# EAGLE schematic Pendant (EAGLE 9.6.2)

## Sheet 1 of 3
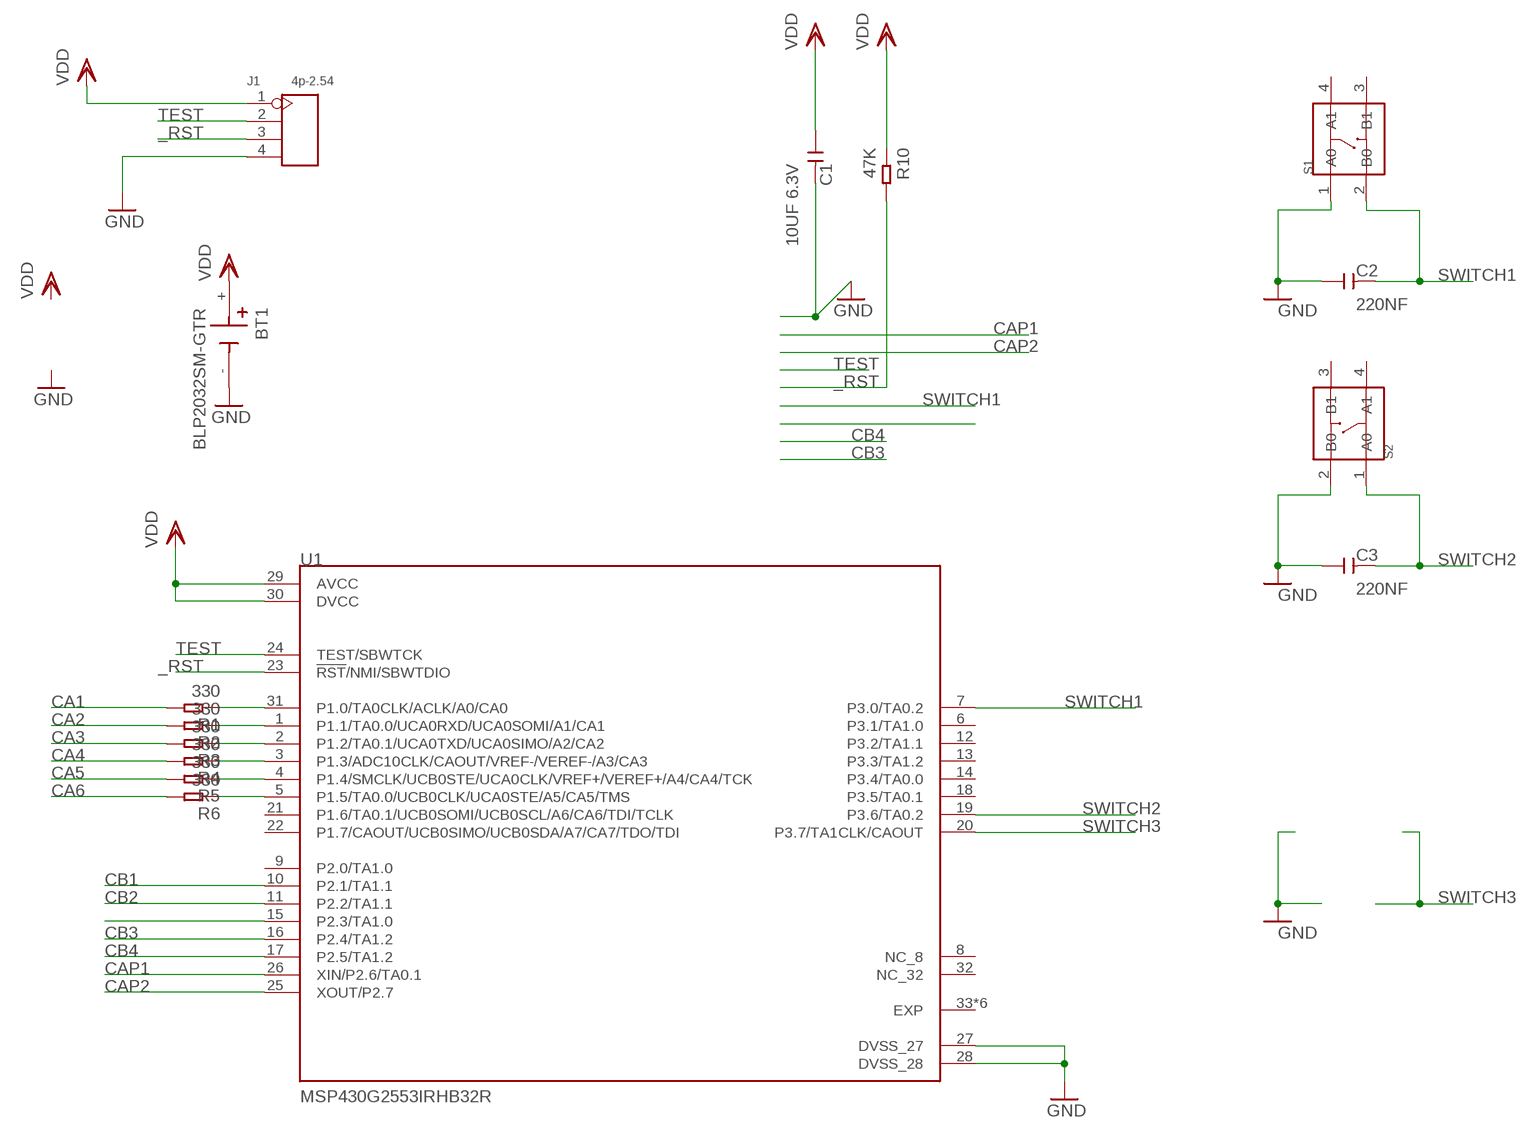
[diagram p0: schematic, sheet 1]

### Parts
BT1  BLP2032SM-GTR  [BAT_BLP2032SM-GTR]
C1  10UF 6.3V  CERAMIC-10UF-6.3V-20%-X5R(0603)  [C0603]
C2  220NF  CERAMIC-220NF-16V-10%-X7R(0402)  [C0402]
C3  220NF  CERAMIC-220NF-16V-10%-X7R(0402)  [C0402]
J1  4p-2.54  DIP-BLACK-MALE-HEADER-VERT(4P-2.54)  [H4-2.54]
R1  330  SMD-RES-330R-5%-1/8W(0805)  [R0805]
R2  330  SMD-RES-330R-5%-1/8W(0805)  [R0805]
R3  330  SMD-RES-330R-5%-1/8W(0805)  [R0805]
R4  330  SMD-RES-330R-5%-1/8W(0805)  [R0805]
R5  330  SMD-RES-330R-5%-1/8W(0805)  [R0805]
R6  330  SMD-RES-330R-5%-1/8W(0805)  [R0805]
R10  47K  SMD-RES-47K-5%-1/10W(0603)  [R0603]
S1  SMD-SWITCH-TACTILE-SPST-NO(4P-D6.0MM)  [SW4-SMD-6.0X6.0X5.0MM]
S2  SMD-SWITCH-TACTILE-SPST-NO(4P-D6.0MM)  [SW4-SMD-6.0X6.0X5.0MM]
U1  MSP430G2553IRHB32R  [IC_MSP430G2553IRHB32R]

### Nets
_RST: J1.3 R10.2 U1.23(!RST!/NMI/SBWTDIO)
CA1: R1.2 ; also sheet 2
CA2: R2.2 ; also sheet 2
CA3: R3.2 ; also sheet 2
CA4: R4.2 ; also sheet 2
CA5: R5.2 ; also sheet 2
CA6: R6.2 ; also sheet 2
CAP1: U1.26(XIN/P2.6/TA0.1)
CAP2: U1.25(XOUT/P2.7)
CB1: U1.10(P2.1/TA1.1) ; also sheet 2
CB2: U1.11(P2.2/TA1.1) ; also sheet 2
CB3: U1.16(P2.4/TA1.2) ; also sheet 2
CB4: U1.17(P2.5/TA1.2) ; also sheet 2
GND: BT1.- C1.2 C2.1 C3.1 J1.4 S1.1(A0) S2.2(B0) U1.27(DVSS_27) U1.28(DVSS_28)
N$2: R1.1 U1.31(P1.0/TA0CLK/ACLK/A0/CA0)
N$6: U1.15(P2.3/TA1.0)
N$10: R2.1 U1.1(P1.1/TA0.0/UCA0RXD/UCA0SOMI/A1/CA1)
N$11: R3.1 U1.2(P1.2/TA0.1/UCA0TXD/UCA0SIMO/A2/CA2)
N$12: R4.1 U1.3(P1.3/ADC10CLK/CAOUT/VREF-/VEREF-/A3/CA3)
N$13: R5.1 U1.4(P1.4/SMCLK/UCB0STE/UCA0CLK/VREF+/VEREF+/A4/CA4/TCK)
N$14: R6.1 U1.5(P1.5/TA0.0/UCB0CLK/UCA0STE/A5/CA5/TMS)
SWITCH1: C2.2 S1.2(B0) U1.7(P3.0/TA0.2)
SWITCH2: C3.2 S2.1(A0) U1.19(P3.6/TA0.2)
SWITCH3: U1.20(P3.7/TA1CLK/CAOUT)
TEST: J1.2 U1.24(TEST/SBWTCK)
VDD: BT1.+ C1.1 J1.1 R10.1 U1.29(AVCC) U1.30(DVCC)
Unconnected: S1.3(B1) S1.4(A1) S2.3(B1) S2.4(A1) U1.6(P3.1/TA1.0) U1.8(NC_8) U1.9(P2.0/TA1.0) U1.12(P3.2/TA1.1) U1.13(P3.3/TA1.2) U1.14(P3.4/TA0.0) U1.18(P3.5/TA0.1) U1.21(P1.6/TA0.1/UCB0SOMI/UCB0SCL/A6/CA6/TDI/TCLK) U1.22(P1.7/CAOUT/UCB0SIMO/UCB0SDA/A7/CA7/TDO/TDI) U1.32(NC_32) U1.33(EXP) U1.34(EXP) U1.35(EXP) U1.36(EXP) U1.37(EXP) U1.38(EXP)

## Sheet 2 of 3
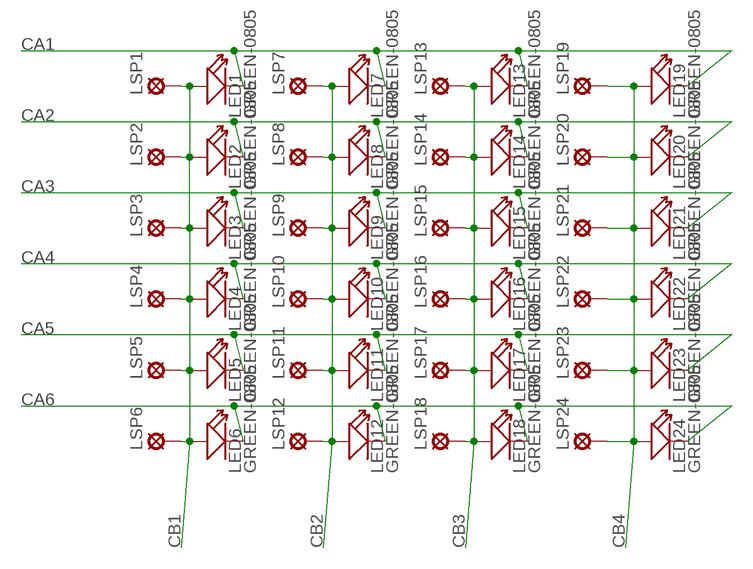
[diagram p1: schematic, sheet 2]

### Parts
LED1  GREEN-0805  SMD-LED-CLEAR-GREEN(0805)  [LED-0805]
LED2  GREEN-0805  SMD-LED-CLEAR-GREEN(0805)  [LED-0805]
LED3  GREEN-0805  SMD-LED-CLEAR-GREEN(0805)  [LED-0805]
LED4  GREEN-0805  SMD-LED-CLEAR-GREEN(0805)  [LED-0805]
LED5  GREEN-0805  SMD-LED-CLEAR-GREEN(0805)  [LED-0805]
LED6  GREEN-0805  SMD-LED-CLEAR-GREEN(0805)  [LED-0805]
LED7  GREEN-0805  SMD-LED-CLEAR-GREEN(0805)  [LED-0805]
LED8  GREEN-0805  SMD-LED-CLEAR-GREEN(0805)  [LED-0805]
LED9  GREEN-0805  SMD-LED-CLEAR-GREEN(0805)  [LED-0805]
LED10  GREEN-0805  SMD-LED-CLEAR-GREEN(0805)  [LED-0805]
LED11  GREEN-0805  SMD-LED-CLEAR-GREEN(0805)  [LED-0805]
LED12  GREEN-0805  SMD-LED-CLEAR-GREEN(0805)  [LED-0805]
LED13  GREEN-0805  SMD-LED-CLEAR-GREEN(0805)  [LED-0805]
LED14  GREEN-0805  SMD-LED-CLEAR-GREEN(0805)  [LED-0805]
LED15  GREEN-0805  SMD-LED-CLEAR-GREEN(0805)  [LED-0805]
LED16  GREEN-0805  SMD-LED-CLEAR-GREEN(0805)  [LED-0805]
LED17  GREEN-0805  SMD-LED-CLEAR-GREEN(0805)  [LED-0805]
LED18  GREEN-0805  SMD-LED-CLEAR-GREEN(0805)  [LED-0805]
LED19  GREEN-0805  SMD-LED-CLEAR-GREEN(0805)  [LED-0805]
LED20  GREEN-0805  SMD-LED-CLEAR-GREEN(0805)  [LED-0805]
LED21  GREEN-0805  SMD-LED-CLEAR-GREEN(0805)  [LED-0805]
LED22  GREEN-0805  SMD-LED-CLEAR-GREEN(0805)  [LED-0805]
LED23  GREEN-0805  SMD-LED-CLEAR-GREEN(0805)  [LED-0805]
LED24  GREEN-0805  SMD-LED-CLEAR-GREEN(0805)  [LED-0805]
LSP1  LSP10  [LSP10]
LSP2  LSP10  [LSP10]
LSP3  LSP10  [LSP10]
LSP4  LSP10  [LSP10]
LSP5  LSP10  [LSP10]
LSP6  LSP10  [LSP10]
LSP7  LSP10  [LSP10]
LSP8  LSP10  [LSP10]
LSP9  LSP10  [LSP10]
LSP10  LSP10  [LSP10]
LSP11  LSP10  [LSP10]
LSP12  LSP10  [LSP10]
LSP13  LSP10  [LSP10]
LSP14  LSP10  [LSP10]
LSP15  LSP10  [LSP10]
LSP16  LSP10  [LSP10]
LSP17  LSP10  [LSP10]
LSP18  LSP10  [LSP10]
LSP19  LSP10  [LSP10]
LSP20  LSP10  [LSP10]
LSP21  LSP10  [LSP10]
LSP22  LSP10  [LSP10]
LSP23  LSP10  [LSP10]
LSP24  LSP10  [LSP10]

### Nets
CA1: LED1.- LED7.- LED13.- LED19.- ; also sheet 1
CA2: LED2.- LED8.- LED14.- LED20.- ; also sheet 1
CA3: LED3.- LED9.- LED15.- LED21.- ; also sheet 1
CA4: LED4.- LED10.- LED16.- LED22.- ; also sheet 1
CA5: LED5.- LED11.- LED17.- LED23.- ; also sheet 1
CA6: LED6.- LED12.- LED18.- LED24.- ; also sheet 1
CB1: LED1.+ LED2.+ LED3.+ LED4.+ LED5.+ LED6.+ LSP1.MP LSP2.MP LSP3.MP LSP4.MP LSP5.MP LSP6.MP ; also sheet 1
CB2: LED7.+ LED8.+ LED9.+ LED10.+ LED11.+ LED12.+ LSP7.MP LSP8.MP LSP9.MP LSP10.MP LSP11.MP LSP12.MP ; also sheet 1
CB3: LED13.+ LED14.+ LED15.+ LED16.+ LED17.+ LED18.+ LSP13.MP LSP14.MP LSP15.MP LSP16.MP LSP17.MP LSP18.MP ; also sheet 1
CB4: LED19.+ LED20.+ LED21.+ LED22.+ LED23.+ LED24.+ LSP19.MP LSP20.MP LSP21.MP LSP22.MP LSP23.MP LSP24.MP ; also sheet 1

## Sheet 3 of 3

## Library data of the parts
BT1 = BLP2032SM-GTR:BLP2032SM-GTR: CR2032 Holder; DESCRIPTION: Battery Holder (Open) Coin, 20.0mm 1 Cell SMD (SMT) Tab; DIGI-KEY_PART_NUMBER: BLP2032SM-GCT-ND; MF: MPD; MP: BLP2032SM-GTR; PACKAGE: Non-Standard MPD; PURCHASE-URL: https://pricing.snapeda.com/search/part/BLP2032SM-GTR/?ref=eda
C1 = OPL_Capacitor:CERAMIC-10UF-6.3V-20%-X5R(0603): 302010286; MPN: CC0603MRX5R5BB106
C2 C3 = OPL_Capacitor:CERAMIC-220NF-16V-10%-X7R(0402): 302010051; MPN: CC0402KRX7R7BB224
J1 = OPL_Connector:DIP-BLACK-MALE-HEADER-VERT(4P-2.54): 320020017; MPN: P125-1104A0BS116A1
LED1-LED24 = OPL_Optoelectronics:SMD-LED-CLEAR-GREEN(0805): 304090057; MPN: 17-215SYGC/S530-E2/TR8
LSP1-LSP24 = solpad-mod:LSP10: SOLDER PAD drill 1.0 mm, distributor Buerklin, 12H555
R1-R6 = OPL_Resistor:SMD-RES-330R-5%-1/8W(0805): 301012196; MPN: RC0805JR-071KL; VALUE: 1K
R10 = OPL_Resistor:SMD-RES-47K-5%-1/10W(0603): 301010084; MPN: RC0603JR-0747KL
S1 S2 = OPL_Switch:SMD-SWITCH-TACTILE-SPST-NO(4P-D6.0MM): 311020004; MPN: DTSM-62K-S-V-T/R(SN431)
U1 = MSP430G2553IRHB32R:MSP430G2553IRHB32R; DESCRIPTION: 16 MHz MCU with 16KB FLASH, 512B SRAM, 10-bit ADC, Comparator, UART/SPI/I2C, Timer 32-VQFN -40 to 85; DIGI-KEY_PART_NUMBER: 296-28643-1-ND; MF: Texas Instruments; MP: MSP430G2553IRHB32R; PACKAGE: VQFN-32 Texas Instruments; PURCHASE-URL: https://pricing.snapeda.com/search/part/MSP430G2553IRHB32R/?ref=eda